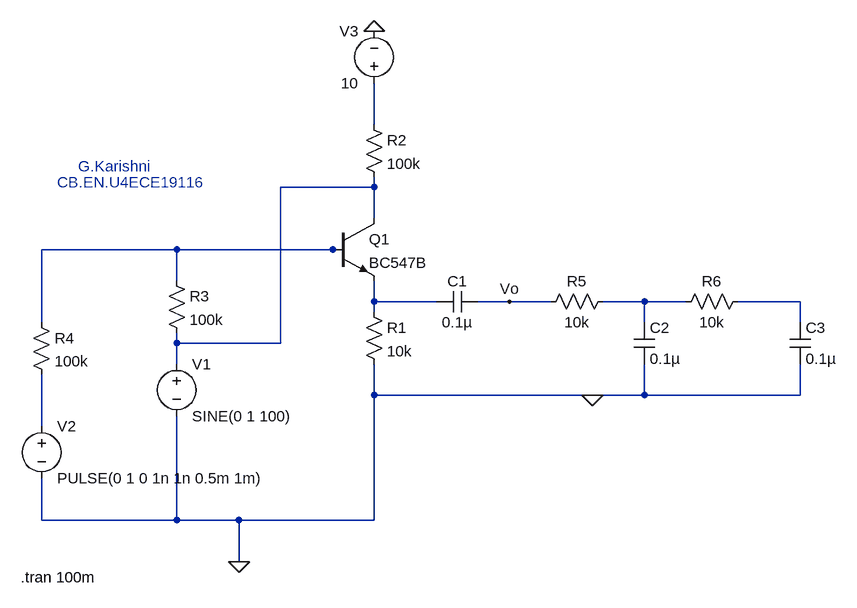
[diagram p0: schematic Draft_demodulation.asc]
Draft_demodulation.asc, the LTspice schematic file:
Version 4
SHEET 1 976 680
WIRE 256 -48 256 -112
WIRE 256 48 256 32
WIRE 256 48 112 48
WIRE 256 96 256 48
WIRE -48 144 -256 144
WIRE 192 144 -48 144
WIRE 208 144 192 144
WIRE -48 192 -48 144
WIRE 256 224 256 192
WIRE 352 224 256 224
WIRE 464 224 416 224
WIRE 528 224 464 224
WIRE 672 224 608 224
WIRE 736 224 672 224
WIRE 912 224 816 224
WIRE 256 240 256 224
WIRE -256 256 -256 144
WIRE 672 256 672 224
WIRE 912 256 912 224
WIRE -48 288 -48 272
WIRE 112 288 112 48
WIRE 112 288 -48 288
WIRE -48 320 -48 288
WIRE 256 368 256 320
WIRE 592 368 256 368
WIRE 672 368 672 320
WIRE 672 368 592 368
WIRE 912 368 912 320
WIRE 912 368 672 368
WIRE -256 416 -256 336
WIRE -256 560 -256 496
WIRE -48 560 -48 400
WIRE -48 560 -256 560
WIRE 48 560 -48 560
WIRE 256 560 256 368
WIRE 256 560 48 560
WIRE 48 624 48 560
FLAG 256 -192 0
FLAG 48 624 0
FLAG 464 224 Vo
FLAG 592 368 0
SYMBOL npn 192 96 R0
SYMATTR InstName Q1
SYMATTR Value BC547B
SYMBOL res 240 -64 R0
SYMATTR InstName R2
SYMATTR Value 100k
SYMATTR SpiceLine tol=1 pwr=0.1
SYMBOL voltage 256 -96 R180
WINDOW 0 24 96 Left 2
WINDOW 3 24 16 Left 2
WINDOW 123 0 0 Left 0
WINDOW 39 0 0 Left 0
SYMATTR InstName V3
SYMATTR Value 10
SYMBOL res 240 224 R0
SYMATTR InstName R1
SYMATTR Value 10k
SYMATTR SpiceLine tol=1 pwr=0.1
SYMBOL cap 416 208 R90
WINDOW 0 0 32 VBottom 2
WINDOW 3 32 32 VTop 2
SYMATTR InstName C1
SYMATTR Value 0.1µ
SYMBOL res -64 176 R0
SYMATTR InstName R3
SYMATTR Value 100k
SYMBOL voltage -48 304 R0
WINDOW 123 0 0 Left 0
WINDOW 39 0 0 Left 0
SYMATTR InstName V1
SYMATTR Value SINE(0 1 100)
SYMBOL voltage -256 400 R0
WINDOW 123 0 0 Left 0
WINDOW 39 0 0 Left 0
SYMATTR InstName V2
SYMATTR Value PULSE(0 1 0 1n 1n 0.5m 1m)
SYMBOL res -272 240 R0
SYMATTR InstName R4
SYMATTR Value 100k
SYMBOL res 624 208 R90
WINDOW 0 0 56 VBottom 2
WINDOW 3 32 56 VTop 2
SYMATTR InstName R5
SYMATTR Value 10k
SYMBOL cap 656 256 R0
SYMATTR InstName C2
SYMATTR Value 0.1µ
SYMBOL res 832 208 R90
WINDOW 0 0 56 VBottom 2
WINDOW 3 32 56 VTop 2
SYMATTR InstName R6
SYMATTR Value 10k
SYMBOL cap 896 256 R0
SYMATTR InstName C3
SYMATTR Value 0.1µ
TEXT -288 648 Left 2 !.tran 100m
TEXT -200 16 Left 2 ;G.Karishni
TEXT -232 40 Left 2 ;CB.EN.U4ECE19116

The netlist it stands for:
* Draft_demodulation.asc
Q1 N002 N003 N004 0 BC547B
R2 N001 N002 100k tol=1 pwr=0.1
V3 N001 0 10
R1 N004 0 10k tol=1 pwr=0.1
C1 Vo N004 0.1µ
R3 N003 N002 100k
V1 N002 0 SINE(0 1 100)
V2 N007 0 PULSE(0 1 0 1n 1n 0.5m 1m)
R4 N003 N007 100k
R5 N005 Vo 10k
C2 N005 0 0.1µ
R6 N006 N005 10k
C3 N006 0 0.1µ
.model NPN NPN
.model PNP PNP
.lib standard.bjt
.tran 100m
* G.Karishni
* CB.EN.U4ECE19116
.backanno
.end